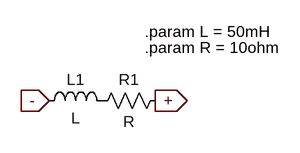
[diagram p0: schematic Motor.asc]
Motor.asc, the LTspice schematic file:
Version 4
SHEET 1 880 680
FLAG 128 144 -
IOPIN 128 144 In
FLAG 288 144 +
IOPIN 288 144 Out
SYMBOL ind 112 160 R270
WINDOW 0 32 56 VTop 2
WINDOW 3 5 56 VBottom 2
SYMATTR InstName L1
SYMBOL res 304 128 R90
WINDOW 0 0 56 VBottom 2
WINDOW 3 32 56 VTop 2
SYMATTR InstName R1
TEXT 272 40 Left 2 !.param L = 50mH
TEXT 272 64 Left 2 !.param R = 10ohm

The netlist it stands for:
* Motor.asc
L1 - P001 L
R1 + P001 R
.param L = 50mH
.param R = 10ohm
.backanno
.end